# Altium schematic sheet BLOCK DIAGRAM.SchDoc: =title
size A3; PageSetup: Record=PageOptions|CenterHorizontal=True|CenterVertical=True|PrintScale=1.00|XCorrection=1.00|YCorrection=1.00|PrintKind=0|BorderSize=5000000|LeftOffset=0|BottomOffset=0|Orientation=2|PaperLength=1000|PaperWidth=1000|Scale=100|PaperSource=15|PrintQuality=600|MediaType=1|DitherType=10|PaperKind=Letter|PrintScaleMode=1; DocumentNumber: 2; SheetNumber: 2; SheetTotal: 9
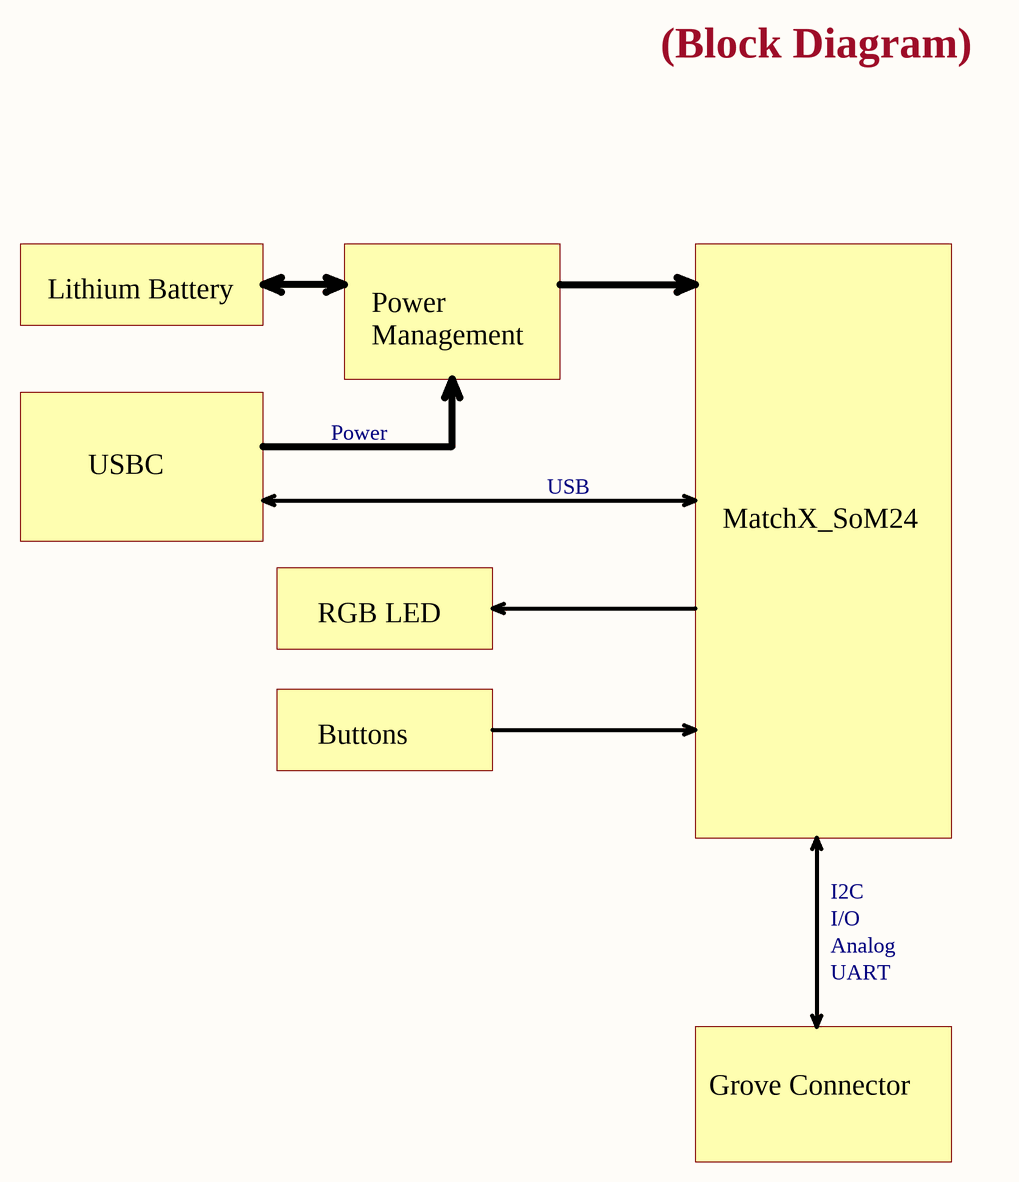
[diagram p0: BLOCK DIAGRAM.SchDoc]

## Notes on the sheet
- (Block Diagram)
- Lithium Battery
- Power
  Management
- USBC
- Power
- USB
- MatchX_SoM24
- RGB LED
- Buttons
- I2C
- I/O
- Analog
- UART
- Grove Connector
- Company:
- CONFIDENTAL. Do not distribute.
- Title:
- Size:
- Date:
- A3
- Number:
- Time:
- Variant:
- Revision:
- Sheet
- of
- File:
- Engineer: